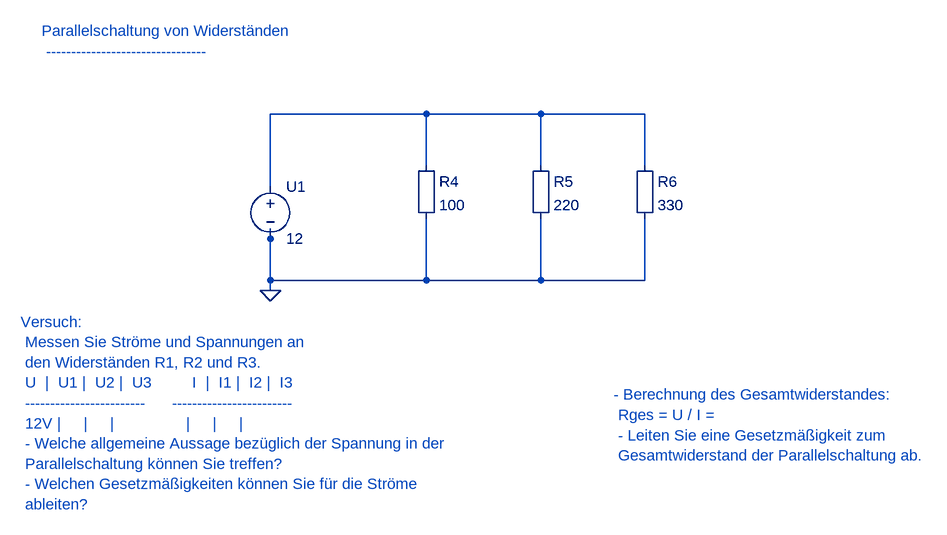
[diagram p0: schematic 1_1_3_Parallelschaltung.asc]
1_1_3_Parallelschaltung.asc, the LTspice schematic file:
Version 4
SHEET 1 880 680
WIRE 416 384 416 368
WIRE 656 272 656 192
WIRE 416 464 416 448
WIRE 656 192 416 192
WIRE 416 192 416 304
WIRE 832 272 832 192
WIRE 832 192 656 192
WIRE 992 272 992 192
WIRE 992 192 832 192
WIRE 416 448 416 368
WIRE 656 352 656 448
WIRE 656 448 416 448
WIRE 832 352 832 448
WIRE 832 448 656 448
WIRE 992 352 992 448
WIRE 992 448 832 448
FLAG 416 464 0
SYMBOL voltage 416 288 R0
SYMATTR InstName U1
SYMATTR Value 12
SYMBOL Misc\EuropeanResistor 640 256 R0
SYMATTR InstName R4
SYMATTR Value 100
SYMBOL Misc\EuropeanResistor 816 256 R0
SYMATTR InstName R5
SYMATTR Value 220
SYMBOL Misc\EuropeanResistor 976 256 R0
SYMATTR InstName R6
SYMATTR Value 330
TEXT 64 64 Left 2 ;Parallelschaltung von Widerständen \n --------------------------------
TEXT 32 512 Left 2 ;Versuch: \n Messen Sie Ströme und Spannungen an \n den Widerständen R1, R2 und R3. \n U  |  U1 |  U2 |  U3         I  |  I1 |  I2 |  I3 \n ------------------------      ------------------------ \n 12V |     |     |                |     |     | \n - Welche allgemeine Aussage bezüglich der Spannung in der \n Parallelschaltung können Sie treffen? \n - Welchen Gesetzmäßigkeiten können Sie für die Ströme \n ableiten?
TEXT 944 624 Left 2 ;- Berechnung des Gesamtwiderstandes: \n Rges = U / I = \n - Leiten Sie eine Gesetzmäßigkeit zum \n Gesamtwiderstand der Parallelschaltung ab.

The netlist it stands for:
* 1_1_3_Parallelschaltung.asc
V§U1 N001 0 12
R4 N001 0 100
R5 N001 0 220
R6 N001 0 330
* Parallelschaltung von Widerständen
*  --------------------------------
* Versuch:
*  Messen Sie Ströme und Spannungen an
*  den Widerständen R1, R2 und R3.
*  U  |  U1 |  U2 |  U3         I  |  I1 |  I2 |  I3
*  ------------------------      ------------------------
*  12V |     |     |                |     |     |
*  - Welche allgemeine Aussage bezüglich der Spannung in der
*  Parallelschaltung können Sie treffen?
*  - Welchen Gesetzmäßigkeiten können Sie für die Ströme
*  ableiten?
* - Berechnung des Gesamtwiderstandes:
*  Rges = U / I =
*  - Leiten Sie eine Gesetzmäßigkeit zum
*  Gesamtwiderstand der Parallelschaltung ab.
.backanno
.end